# Altium schematic sheet L Subsys1.SchDoc
size A; SheetNumber: 9; SheetTotal: 11
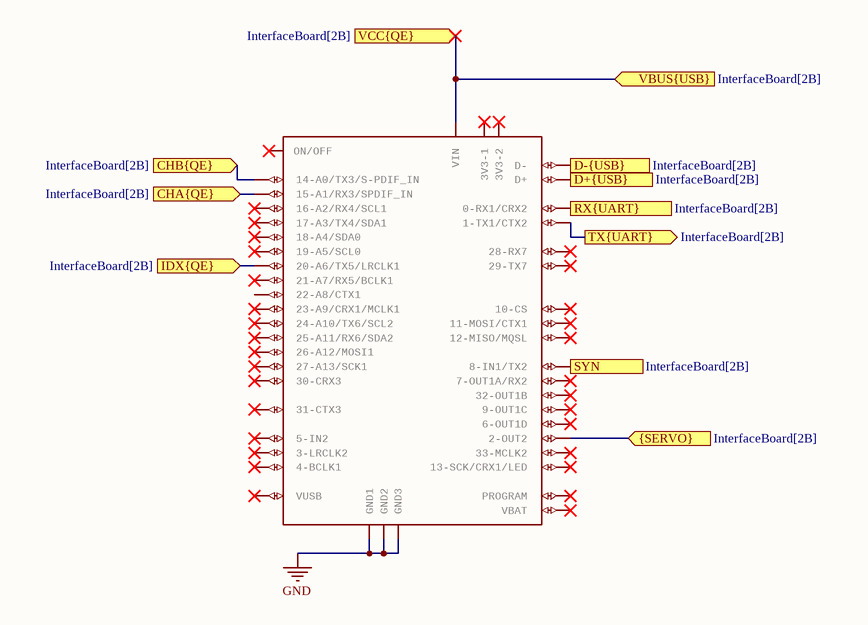
[diagram p0: L Subsys1.SchDoc]

## Parts
UL  DEV-16771  [TEENSY40]  (value not drawn)

## Ports
CHA{QE} (in, see InterfaceBoard[2B]), CHB{QE} (in, see InterfaceBoard[2B]), D+{USB} (in, see InterfaceBoard[2B]), D-{USB} (in, see InterfaceBoard[2B]), IDX{QE} (in, see InterfaceBoard[2B]), RX{UART} (in, see InterfaceBoard[2B]), SYN (in, see InterfaceBoard[2B]), TX{UART} (out, see InterfaceBoard[2B]), VBUS{USB} (in, see InterfaceBoard[2B]), VCC{QE} (in, see InterfaceBoard[2B]), {SERVO} (in, see InterfaceBoard[2B])

## Nets
GND: UL.GND1 UL.GND2 UL.GND3
CHA{QE}: UL.15-A1/RX3/S-PDIF_IN(15-A1/RX3/SPDIF_IN) ; port CHA{QE}
CHB{QE}: UL.14-A0/TX3/S-PFI_OUT(14-A0/TX3/S-PDIF_IN) ; port CHB{QE}
D+{USB}: UL.D+ ; port D+{USB}
D-{USB}: UL.D- ; port D-{USB}
IDX{QE}: UL.20-A6/TX5/LRCLK1 ; port IDX{QE}
RX{UART}: UL.0-RX1(0-RX1/CRX2) ; port RX{UART}
SYN: UL.8-TX2/IN1(8-IN1/TX2) ; port SYN
TX{UART}: UL.1-TX1(1-TX1/CTX2) ; port TX{UART}
VBUS{USB}: UL.VIN ; port VBUS{USB}, port VCC{QE}
{SERVO}: UL.2-OUT2 ; port {SERVO}

Not connected (* = marked no-connect by the designer): UL 3-LRCLK2* 3V3-1* 3V3-2* 4-BCLK2(4-BCLK1)* 5-IN2* 6-OUT1D* 7-RX2/OUT1A(7-OUT1A/RX2)* 9-OUT1C* 10-CS/MQSR(10-CS)* 11-MOSI/CTX1* 12-MIO/MQSL(12-MISO/MQSL)* 13-SCK/CRX1/LED* 16-A2/RX4/SCL1* 17-A3/TX4/SDA1* 18-A4/SDA0* 19-A5/SCL0* 21-A7/RX5/BCLK1* 22-A8/CTX1 23-A9/CRX1/CCLK1(23-A9/CRX1/MCLK1)* 24-A10/TX6/SCL2* 25-A11/SDA2(25-A11/RX6/SDA2)* 26-A12/MOSI1* 27-A13/SCK1* 28-RX7* 29-TX7* 30-CRX3* 31-CTX3* 32-OUTB1(32-OUT1B)* 33-MCLK2* ON/OFF* PROGRAM* VBAT* VUSB*

## Library data of the parts
UL = TEENSY40: GateName_1: G$1; SymbolName_1: TEENSY40; LibraryName: TEENSYV1; DeviceSetName: TEENSY40; Package: TEENSY40